# Altium schematic sheet Sheet1.SchDoc: Название схемы
size 420 x 297 mm; ApprovedBy: Человек 1; CheckedBy: Человек 3; Author: Человек 2; DrawnBy: Человек; DocumentNumber: АЕСН.ХХХХХХ.ХХХЭ3; SheetNumber: x; SheetTotal: x; DocumentName: Sheet1.SCHDOC
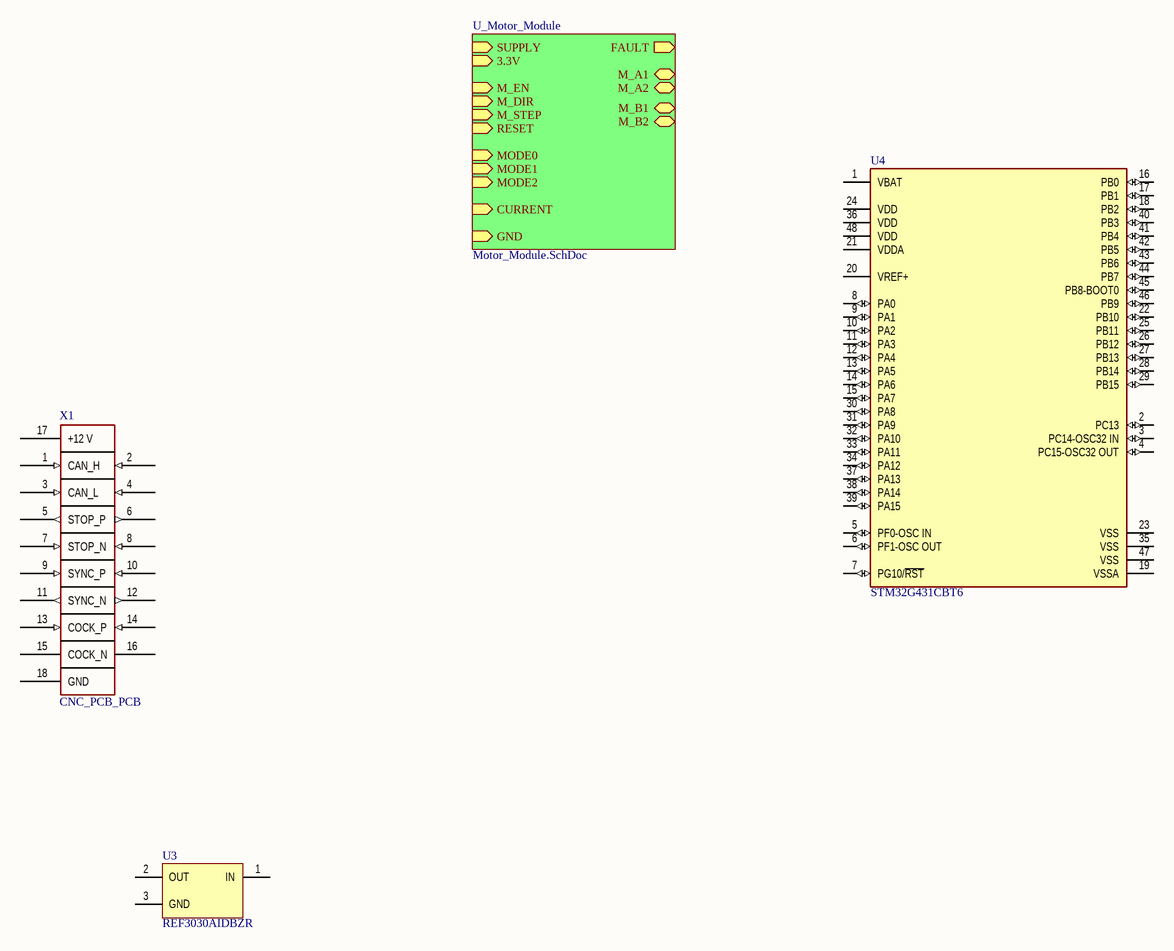
[diagram p0: Sheet1.SchDoc]

## Parts
U3  REF3030AIDBZR  [DBZ0003A_N]
U4  STM32G431CBT6  [FP-LQFP48-5B-MFG]
X1  CNC_PCB_PCB  [CNC_PCB_PCB]

## Sub-sheets
U_Motor_Module = Motor_Module.SchDoc: M_A1 (bidir), M_A2 (bidir), M_B1 (bidir), M_B2 (bidir), M_EN (in), M_STEP (in), M_DIR (in), SUPPLY (in), GND (in), RESET (in), FAULT (out), MODE0 (in), MODE1 (in), MODE2 (in), CURRENT (in), 3.3V (in)

## Nets

Not connected (* = marked no-connect by the designer): U3 1(IN) 2(OUT) 3(GND); U4 1(VBAT) 2(PC13) 3(PC14-OSC32_IN) 4(PC15-OSC32_OUT) 5(PF0-OSC_IN) 6(PF1-OSC_OUT) 7(PG10/~{RST}) 8(PA0) 9(PA1) 10(PA2) 11(PA3) 12(PA4) 13(PA5) 14(PA6) 15(PA7) 16(PB0) 17(PB1) 18(PB2) 19(VSSA) 20(VREF+) 21(VDDA) 22(PB10) 23(VSS) 24(VDD) 25(PB11) 26(PB12) 27(PB13) 28(PB14) 29(PB15) 30(PA8) 31(PA9) 32(PA10) 33(PA11) 34(PA12) 35(VSS) 36(VDD) 37(PA13) 38(PA14) 39(PA15) 40(PB3) 41(PB4) 42(PB5) 43(PB6) 44(PB7) 45(PB8-BOOT0) 46(PB9) 47(VSS) 48(VDD); X1 1(CAN_H) 2(CAN_H) 3(CAN_L) 4(CAN_L) 5(STOP_P) 6(STOP_P) 7(STOP_N) 8(STOP_N) 9(SYNC_P) 10(SYNC_P) 11(SYNC_N) 12(SYNC_N) 13(COCK_P) 14(COCK_P) 15(COCK_N) 16(COCK_N) 17(+12_V) 18(GND)

## Notes on the sheet
- Перв.примен.
- Справ. №
- Подп. и дата
- Инв.№ дубл.
- Взам. инв. №
- Изм.
- Лист
- № докум.
- Подп.
- Дата
- Лит.
- Масса
- Масштаб
- Пров.
- Т.контр
- Разраб.
- Схема электрическая принципиальная
- 1
- Листов
- Инв № подл.
- Н.контр.
- Утв.
- Копировал
- Формат А3

## Library data of the parts
U3 = CMP-0367-00160-2: 2.048 V, 50 ppm / degC, 50 uA Series (Bandgap) Voltage Reference, -40 to 125 degC, 3-pin SOT-23 (DBZ), Green (RoHS & no Sb/Br); ComponentLink1URL: http://www.ti.com/; ComponentLink3URL: http://www.ti.com/litv/pdf/mpds108a; ComponentLink2URL: http://www.ti.com/general/docs/lit/getliterature.tsp?genericPartNumber=REF3020&fileType=pdf; ComponentLink3Description: Package Specification; ComponentLink4Description: URL Link1; ComponentLink2Description: Datasheet; ComponentLink4URL: Samples URL:http://www.ti.com/product/ref3020; ComponentLink1Description: Manufacturer URL; Model: REF3030AIDBZR; Type: IC
U4 = CMP-12105-000030-1: MAINSTREAM ARM CORTEX-M4+ MCU 17; Manufacturer: STMicroelectronics; Number Of Adc Channels: 17; Number Of I/Os: 38; Standoff Height: 0.05mm; Number Of Usb Channels: 1; Data Bus Width: 32bits; Number Of I2C Channels: 3; Number Of Pwm Channels: 31; Frequency: 170MHz; Memory Type: FLASH; Number Of Timers/Counters: 14; Ram Size: 32KBytes; Max Junction Temp: +105°C; Memory Size: 128KBytes; Min Supply Voltage: 1.62V; Description: ARM® Cortex®-M4F STM32G4 Microcontroller IC 32-Bit 170MHz 128KB (128K x 8) FLASH 48-LQFP (7x7); Max Supply Voltage: 3.6V; Number Of Uart Channels: 4; Interface: I2C,SPI,UART,USART,CAN,USB,LIN,IrDA,I2S; Temperature Range Low: -40°C; Lead Free: Yes; Device Class L3: Microcontrollers; Number Of Cores: 1; Temperature Range High: +85°C; Height: 1.6mm; Digikey Description: MAINSTREAM ARM CORTEX-M4+ MCU 17; Device Class L1: Integrated Circuits (ICs); Package: LQFP48-5B; RoHS: TRUE; Number Of A/D Converters: 1; Core Architecture: Arm Cortex-M4; Device Class L2: Embedded Processors and Controllers; ComponentLink2Description: Datasheet; Temperature: -40°C to +85°C; Ambient Temperature Range High: +85°C; Ambient Temperature Range Low: -40°C; Octopart: https://octopart.com/stm32g431cbt6-stmicroelectronics-98835224; ComponentLink2URL: https://www.st.com/resource/en/datasheet/stm32g431cb.pdf; Automotive: No; Number Of Spi Channels: 3; Manufacturer Part Number: STM32G431CBT6; Category: IC